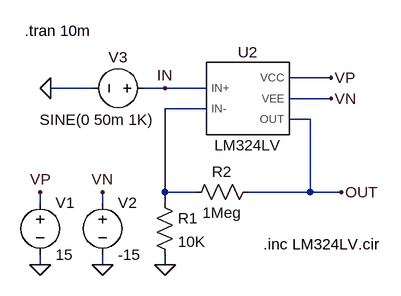
[diagram p0: schematic Fig_10-12-app_LM324LV_Symbol-Auto.asc]
Fig_10-12-app_LM324LV_Symbol-Auto.asc, the LTspice schematic file:
Version 4
SHEET 1 880 680
WIRE 352 80 288 80
WIRE -16 96 -80 96
WIRE 96 96 64 96
WIRE 160 96 96 96
WIRE 352 112 288 112
WIRE 160 128 96 128
WIRE 320 144 288 144
WIRE 96 256 96 128
WIRE 144 256 96 256
WIRE 320 256 320 144
WIRE 320 256 224 256
WIRE 368 256 320 256
WIRE -96 272 -96 256
WIRE 0 272 0 256
WIRE 96 272 96 256
WIRE -96 368 -96 352
WIRE 0 368 0 352
WIRE 96 368 96 352
FLAG -80 96 0
FLAG -96 368 0
FLAG 0 368 0
FLAG 96 368 0
FLAG -96 256 VP
FLAG 352 80 VP
FLAG 0 256 VN
FLAG 352 112 VN
FLAG 368 256 OUT
FLAG 96 96 IN
SYMBOL voltage -96 256 R0
WINDOW 123 24 138 Left 2
WINDOW 39 24 117 Left 2
SYMATTR InstName V1
SYMATTR Value 15
SYMBOL voltage 0 256 R0
WINDOW 123 24 138 Left 2
WINDOW 39 24 117 Left 2
SYMATTR InstName V2
SYMATTR Value -15
SYMBOL voltage 80 96 R90
WINDOW 0 -32 56 VBottom 2
WINDOW 3 33 89 VTop 2
WINDOW 123 74 56 VTop 2
WINDOW 39 53 56 VTop 2
SYMATTR InstName V3
SYMATTR Value SINE(0 50m 1K)
SYMBOL res 80 256 R0
SYMATTR InstName R1
SYMATTR Value 10K
SYMBOL res 128 272 R270
WINDOW 0 32 56 VTop 2
WINDOW 3 0 56 VBottom 2
SYMATTR InstName R2
SYMATTR Value 1Meg
SYMBOL LM324LV 224 112 R0
SYMATTR InstName U2
TEXT -120 8 Left 2 !.tran 10m
TEXT 248 336 Left 2 !.inc LM324LV.cir

The netlist it stands for:
* Fig_10-12-app_LM324LV_Symbol-Auto.asc
V1 VP 0 15
V2 VN 0 -15
V3 IN 0 SINE(0 50m 1K)
R1 N001 0 10K
R2 N001 OUT 1Meg
XU2 IN N001 VP VN OUT LM324LV  ; pins IN+ IN- VCC VEE OUT
.tran 10m
.inc LM324LV.cir
.lib C:\Users\shibu\Desktop\TOP\_5__Publishing\Ohm-Sha\LTspice__4th-Ed_Draft\Rev4_ASC\Chap_10\LM324LV.cir
.backanno
.end